# Altium schematic sheet micro.SchDoc
size A
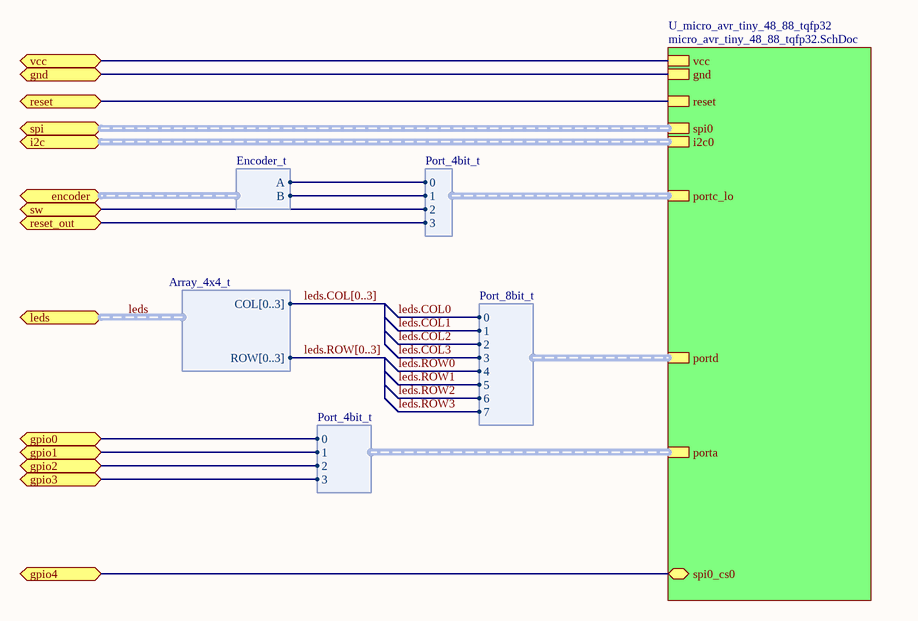
[diagram p0: micro.SchDoc]

## Sub-sheets
U_micro_avr_tiny_48_88_tqfp32 = micro_avr_tiny_48_88_tqfp32.SchDoc: vcc, gnd, spi0 (harness Spi_t), reset, portc_lo (harness Port_4bit_t), i2c0 (harness I2c_t), portd (harness Port_8bit_t), porta (harness Port_4bit_t), spi0_cs0

## Ports
encoder (harness Encoder_t), gnd, gpio0, gpio1, gpio2, gpio3, gpio4, i2c (harness i2c_t), leds (harness Array_4x4_t), reset, reset_out, spi (harness Spi_t), sw, vcc

## Harnesses
Encoder_t: A, B
Port_4bit_t: 0, 1, 2, 3
Port_8bit_t: 0, 1, 2, 3, 4, 5, 6, 7
Array_4x4_t: COL[0..3], ROW[0..3]

## Nets
gnd: port gnd, sheet U_micro_avr_tiny_48_88_tqfp32/gnd
gpio0: port gpio0, sheet U_micro_avr_tiny_48_88_tqfp32/porta.0
gpio1: port gpio1, sheet U_micro_avr_tiny_48_88_tqfp32/porta.1
gpio2: port gpio2, sheet U_micro_avr_tiny_48_88_tqfp32/porta.2
gpio3: port gpio3, sheet U_micro_avr_tiny_48_88_tqfp32/porta.3
gpio4: port gpio4, sheet U_micro_avr_tiny_48_88_tqfp32/spi0_cs0
leds.COL0: sheet U_micro_avr_tiny_48_88_tqfp32/portd.0
leds.COL1: sheet U_micro_avr_tiny_48_88_tqfp32/portd.1
leds.COL2: sheet U_micro_avr_tiny_48_88_tqfp32/portd.2
leds.COL3: sheet U_micro_avr_tiny_48_88_tqfp32/portd.3
leds.ROW0: sheet U_micro_avr_tiny_48_88_tqfp32/portd.4
leds.ROW1: sheet U_micro_avr_tiny_48_88_tqfp32/portd.5
leds.ROW2: sheet U_micro_avr_tiny_48_88_tqfp32/portd.6
leds.ROW3: sheet U_micro_avr_tiny_48_88_tqfp32/portd.7
reset: port reset, sheet U_micro_avr_tiny_48_88_tqfp32/reset
reset_out: port reset_out, sheet U_micro_avr_tiny_48_88_tqfp32/portc_lo.3
sw: port sw, sheet U_micro_avr_tiny_48_88_tqfp32/portc_lo.2
vcc: port vcc, sheet U_micro_avr_tiny_48_88_tqfp32/vcc
(unnamed): port encoder.A, sheet U_micro_avr_tiny_48_88_tqfp32/portc_lo.0
(unnamed): port encoder.B, sheet U_micro_avr_tiny_48_88_tqfp32/portc_lo.1

## Buses and harness runs
bus leds.COL[0..3]
bus leds.ROW[0..3]
harness leds = port leds
harness port i2c = sheet U_micro_avr_tiny_48_88_tqfp32/i2c0
harness port spi = sheet U_micro_avr_tiny_48_88_tqfp32/spi0